# EasyEDA Pro project ProProject_下载器_2024-08-05.epro

# Schematic Schematic1
Create Date: 2024-07-26; Page Name: P1; Project Name: 下载器; Schematic Name: Schematic1; Update Date: 2024-07-26; Company: 嘉立创EDA; Page Size: A4; Version: V1.0
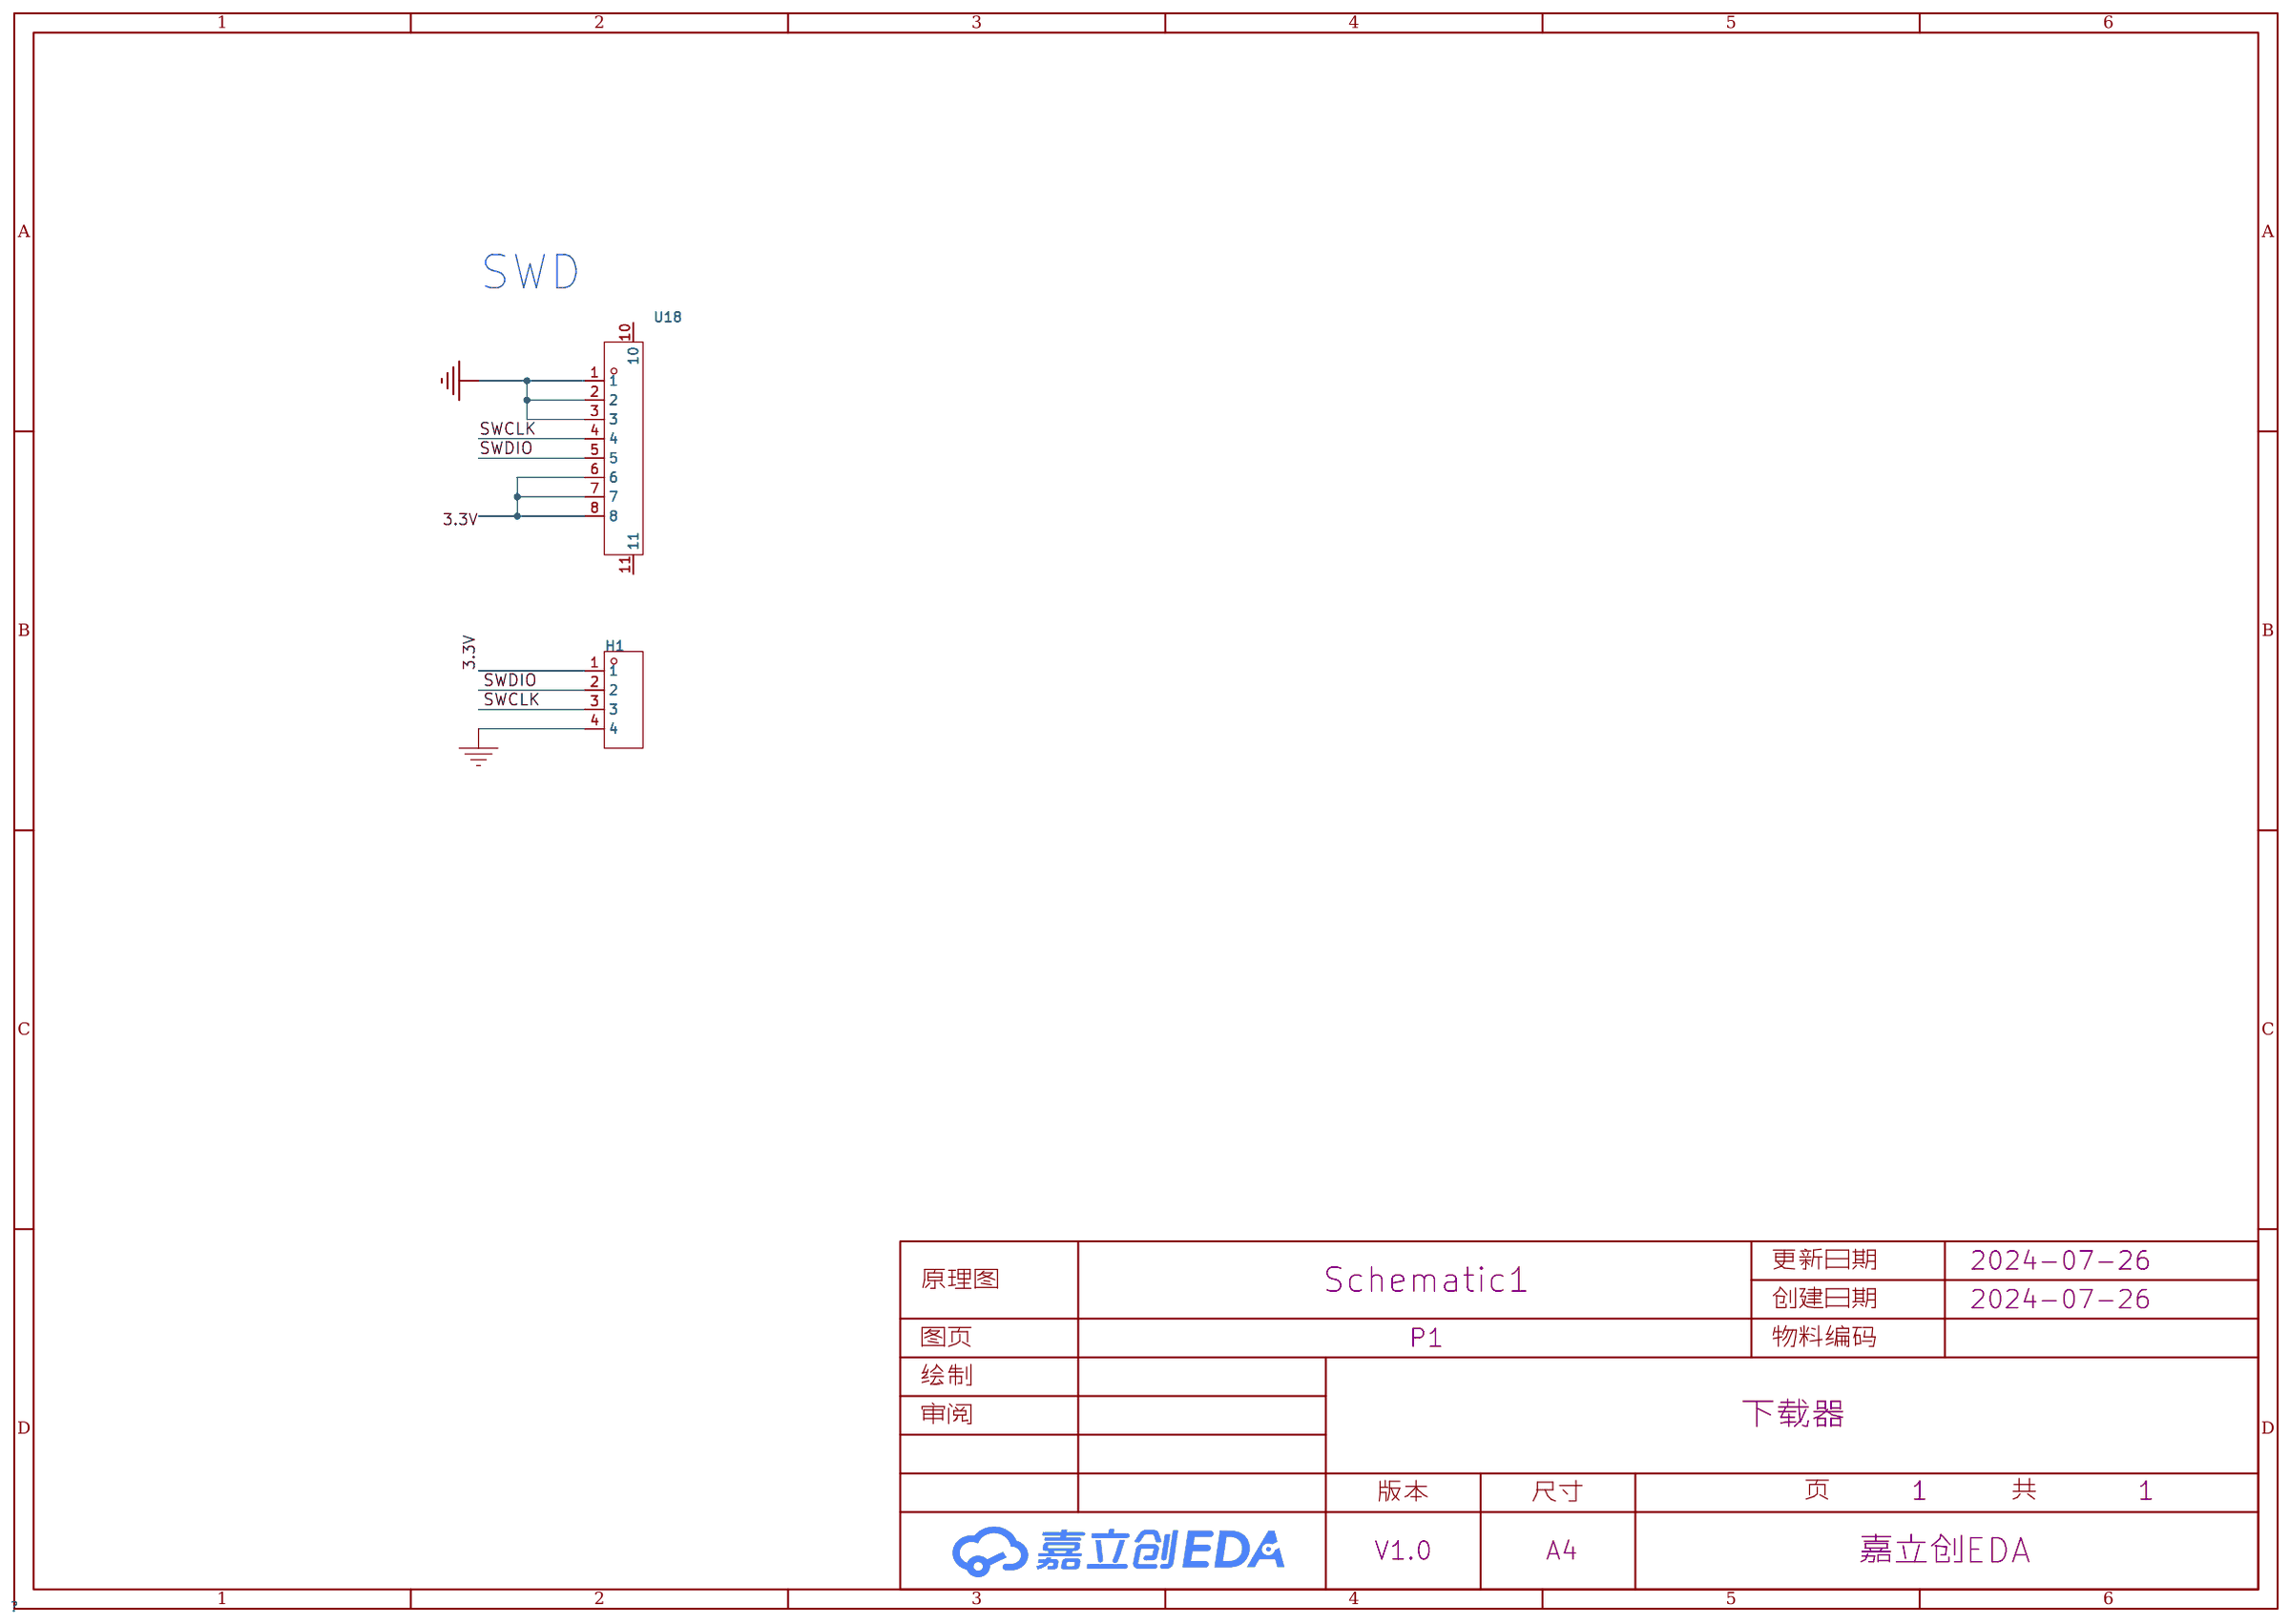
[diagram p0: schematic sheet]

## Parts
H1  -  [HDR-TH_4P-P2.54-V-M]
U18  SMTFPC连接器0.5MM间距翻盖8PIN  [FPC-SMD_AFC01-S08FCC-00]

## Library data of the parts
H1 = HDR-M_2.54_1x4P: Supplier Part: C492403; Supplier Footprint: 插件
U18 = SMTFPC连接器0.5MM间距翻盖8PIN: Supplier Part: C9900001730; JLCPCB Part Class: Extended Part; Datasheet: 2021-11-11/570927A/0f6bb2f581574a4697c3d67af550caf2/10301099.pdf; Supplier: LCSC

## Nets
3.3V: H1.1 U18.6 U18.7 U18.8
GND: H1.4 U18.1 U18.2 U18.3
SWCLK: H1.3 U18.4
SWDIO: H1.2 U18.5

Not connected (* = marked no-connect by the designer): U18 10 11

## Notes on the sheet
- SWD

# Board PCB1
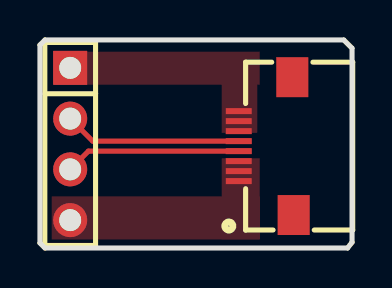
[diagram p1: board, top side]
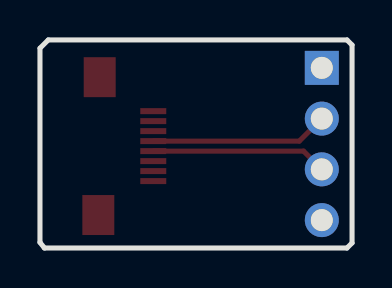
[diagram p2: board, bottom side, seen from below]

Outline 15.62 x 10.41 mm; copper layers: Top Layer, Bottom Layer. Coordinates in mm from the lower left corner of the outline.
Outline path: 0,10.16 0,0.25 0.25,0 15.4,0 15.62,0.28 15.62,10 15.21,10.41 0.25,10.41 0,10.16
Stack: Top Layer 0.035mm / Dielectric1 1.51mm FR4 er 4.5 / Bottom Layer 0.035mm

## Design rules (mm)
template: JLCPCB Capability(Two Layers Board)
spacing copperThickness1oz (default): track to track 0.102, other pairs 0.152 to 0.3
spacing copperThickness2oz: track to track 0.203, other pairs 0.152 to 0.3
track width copperThickness1oz (default): min 0.127, default 0.254, max 2.54
track width copperThickness2oz: min 0.203, default 0.254, max 2.54
differential pair differentialPair (default): width min 0.127, default 0.254, max 2.54; gap min 0.152, default 0.152
via viaSize (default): diameter min 0.5, default 0.61, max 10; hole min 0.3, default 0.305, max 6.3

## Placement (name value [footprint] x y rotation side)
H1  -  [HDR-TH_4P-P2.54-V-M]  1.51 5.21 270 top
U18  SMTFPC连接器0.5MM间距翻盖8PIN  [FPC-SMD_AFC01-S08FCC-00]  11.32 5.1 90 top

## Footprints (pads in the part's own frame, mm; a bottom-side part is the same pattern mirrored in y, then rotated)
FPC-SMD_AFC01-S08FCC-00
  rect 0.3x1.3 smd: 1(-1.75,1.375) 2(-1.251,1.375) 3(-0.751,1.375) 4(-0.251,1.375) 5(0.25,1.375) 6(0.75,1.375) 7(1.25,1.375) 8(1.75,1.375)
  rect 2x1.6 smd: 10(-3.45,-1.375) 11(3.45,-1.306)
HDR-TH_4P-P2.54-V-M
  rect 1.7x1.7 hole 1.1: 1(-3.81,0)
  round 1.7 hole 1.1: 2(-1.27,0) 3(1.27,0) 4(3.81,0)

## Nets
As in the schematic.

Pads without a net: U18 10 11

## Routing (per net, layer and track width the routed paths; a pad name or vN(x,y) marks a point on that pad's centre or on a via; arc(x,y) is an arc through that point)
SWCLK: length 8.8
  Top Layer w0.254: U18.4 2.43,4.85 H1.3
SWDIO: length 8.9
  Top Layer w0.254: H1.2 2.64,5.35 U18.5

## Copper pours and planes (outline as drawn; the poured copper is in the pictures)
3.3V on Top Layer: 9.1,9.7 10.88,9.7 10.88,5.76 9.1,5.76
3.3V on Top Layer: 0.72,9.83 11,9.83 11,8.17 0.72,8.17
GND on Top Layer: 9.1,4.49 11,4.49 11,0.44 9.1,0.44
GND on Top Layer: 0.59,2.59 11,2.59 11,0.43 0.59,0.43
